# Altium schematic sheet 04_CONNECTOR_OUT.SchDoc
size 420 x 297 mm; SheetNumber: 5; SheetTotal: 28
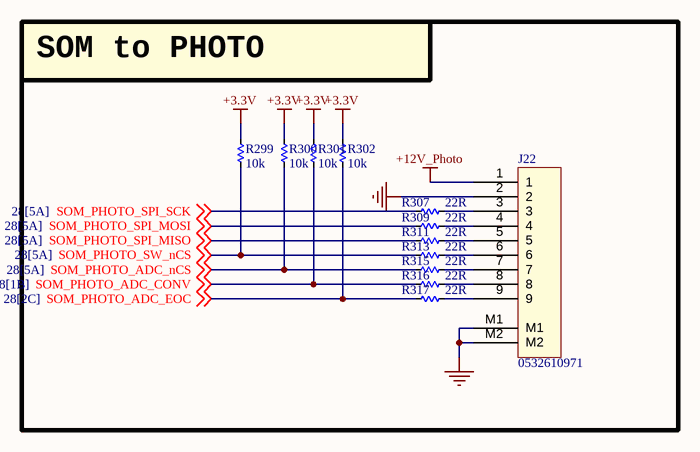
[diagram p0: 04_CONNECTOR_OUT.SchDoc]

## Parts
J22  0532610971  [MOLEX_0532610971]
R299  10k  [RES_C_1005X40]
R300  10k  [RES_C_1005X40]
R301  10k  [RES_C_1005X40]
R302  10k  [RES_C_1005X40]
R307  22R  [RES_C_1005X40]
R309  22R  [RES_C_1005X40]
R311  22R  [RES_C_1005X40]
R313  22R  [RES_C_1005X40]
R315  22R  [RES_C_1005X40]
R316  22R  [RES_C_1005X40]
R317  22R  [RES_C_1005X40]

## Blocks framed on the sheet
SOM to PHOTO: J22 R299-R302 R307 R309 R311 R313 R315-R317

## Nets
+3.3V: R299.1 R300.1 R301.1 R302.1
+12V_Photo: J22.1
GND: J22.2 J22.M1 J22.M2
SOM_PHOTO_ADC_CONV: R301.2 R316.1 ; off-sheet SOM_PHOTO_ADC_CONV
SOM_PHOTO_ADC_EOC: R302.2 R317.1 ; off-sheet SOM_PHOTO_ADC_EOC
SOM_PHOTO_ADC_nCS: R300.2 R315.1 ; off-sheet SOM_PHOTO_ADC_nCS
SOM_PHOTO_SPI_MISO: R311.1 ; off-sheet SOM_PHOTO_SPI_MISO
SOM_PHOTO_SPI_MOSI: R309.1 ; off-sheet SOM_PHOTO_SPI_MOSI
SOM_PHOTO_SPI_SCK: R307.1 ; off-sheet SOM_PHOTO_SPI_SCK
SOM_PHOTO_SW_nCS: R299.2 R313.1 ; off-sheet SOM_PHOTO_SW_nCS
NetJ22_3: J22.3 R307.2
NetJ22_4: J22.4 R309.2
NetJ22_5: J22.5 R311.2
NetJ22_6: J22.6 R313.2
NetJ22_7: J22.7 R315.2
NetJ22_8: J22.8 R316.2
NetJ22_9: J22.9 R317.2

## Notes on the sheet
- Project:
- Sub-system:
- Design by:
- Sheet title:
- Sheet
- of
- Checked by:
- Approved by:
- Revision:
- Document No:
- Size:
- Date:
- A3

## Library data of the parts
J22 = Header 9x1_2M
R299-R302 R307 R309 R311 R313 R315-R317 = _RES_B_2: RES